# Altium schematic sheet GD30E103.SchDoc
size A4
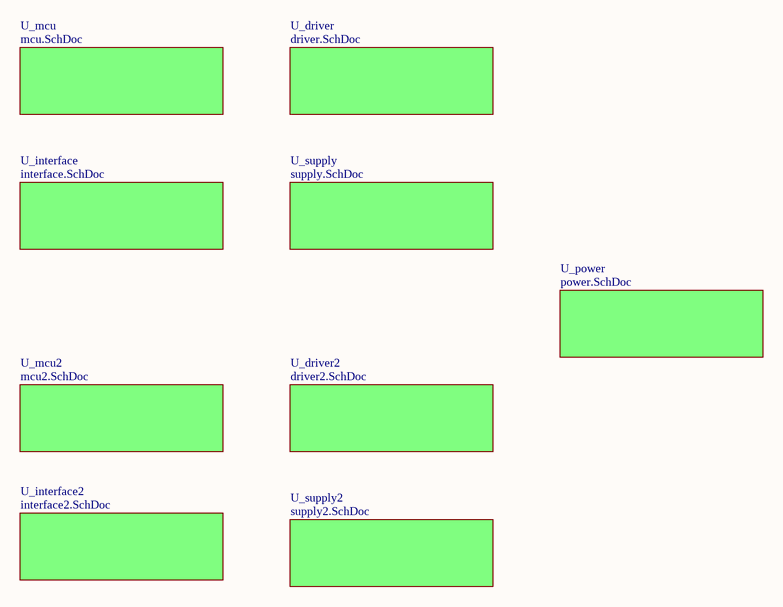
[diagram p0: GD30E103.SchDoc]

## Sub-sheets
U_driver = driver.SchDoc: no entries
U_driver2 = driver2.SchDoc: no entries
U_interface = interface.SchDoc: no entries
U_interface2 = interface2.SchDoc: no entries
U_mcu = mcu.SchDoc: no entries
U_mcu2 = mcu2.SchDoc: no entries
U_power = power.SchDoc: no entries
U_supply = supply.SchDoc: no entries
U_supply2 = supply2.SchDoc: no entries